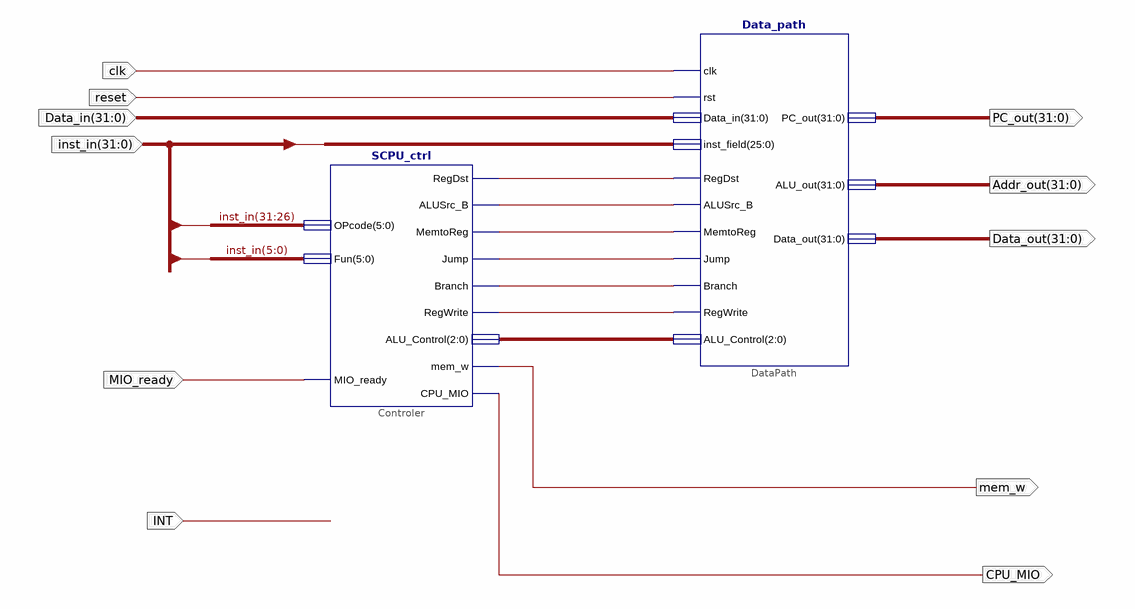
[diagram p0: schematic sheet 1]
// Xilinx ISE schematic SCPU.sch (kintex7) as structural Verilog: 2 symbols, 11 ports
module SCPU (
  input  MIO_ready,
  input  INT,
  input  [31:0] Data_in,
  input  reset,
  input  clk,
  input  [31:0] inst_in,
  output mem_w,
  output CPU_MIO,
  output [31:0] PC_out,
  output [31:0] Addr_out,
  output [31:0] Data_out
);

  wire XLXN_1, XLXN_2, XLXN_3, XLXN_5, XLXN_6, XLXN_7;
  wire [2:0] XLXN_8;

  Data_path DataPath (
    .RegDst(XLXN_1), .ALUSrc_B(XLXN_2), .MemtoReg(XLXN_3), .Jump(XLXN_5), .Branch(XLXN_6), .RegWrite(XLXN_7),
    .ALU_Control(XLXN_8), .Data_in(Data_in), .inst_field(inst_in[25:0]), .clk(clk), .rst(reset),
    .PC_out(PC_out), .ALU_out(Addr_out), .Data_out(Data_out));
  SCPU_ctrl Controler (
    .RegDst(XLXN_1), .ALUSrc_B(XLXN_2), .MemtoReg(XLXN_3), .Jump(XLXN_5), .Branch(XLXN_6), .RegWrite(XLXN_7),
    .ALU_Control(XLXN_8), .CPU_MIO(CPU_MIO), .mem_w(mem_w), .Fun(inst_in[5:0]), .MIO_ready(MIO_ready),
    .OPcode(inst_in[31:26]));
endmodule
